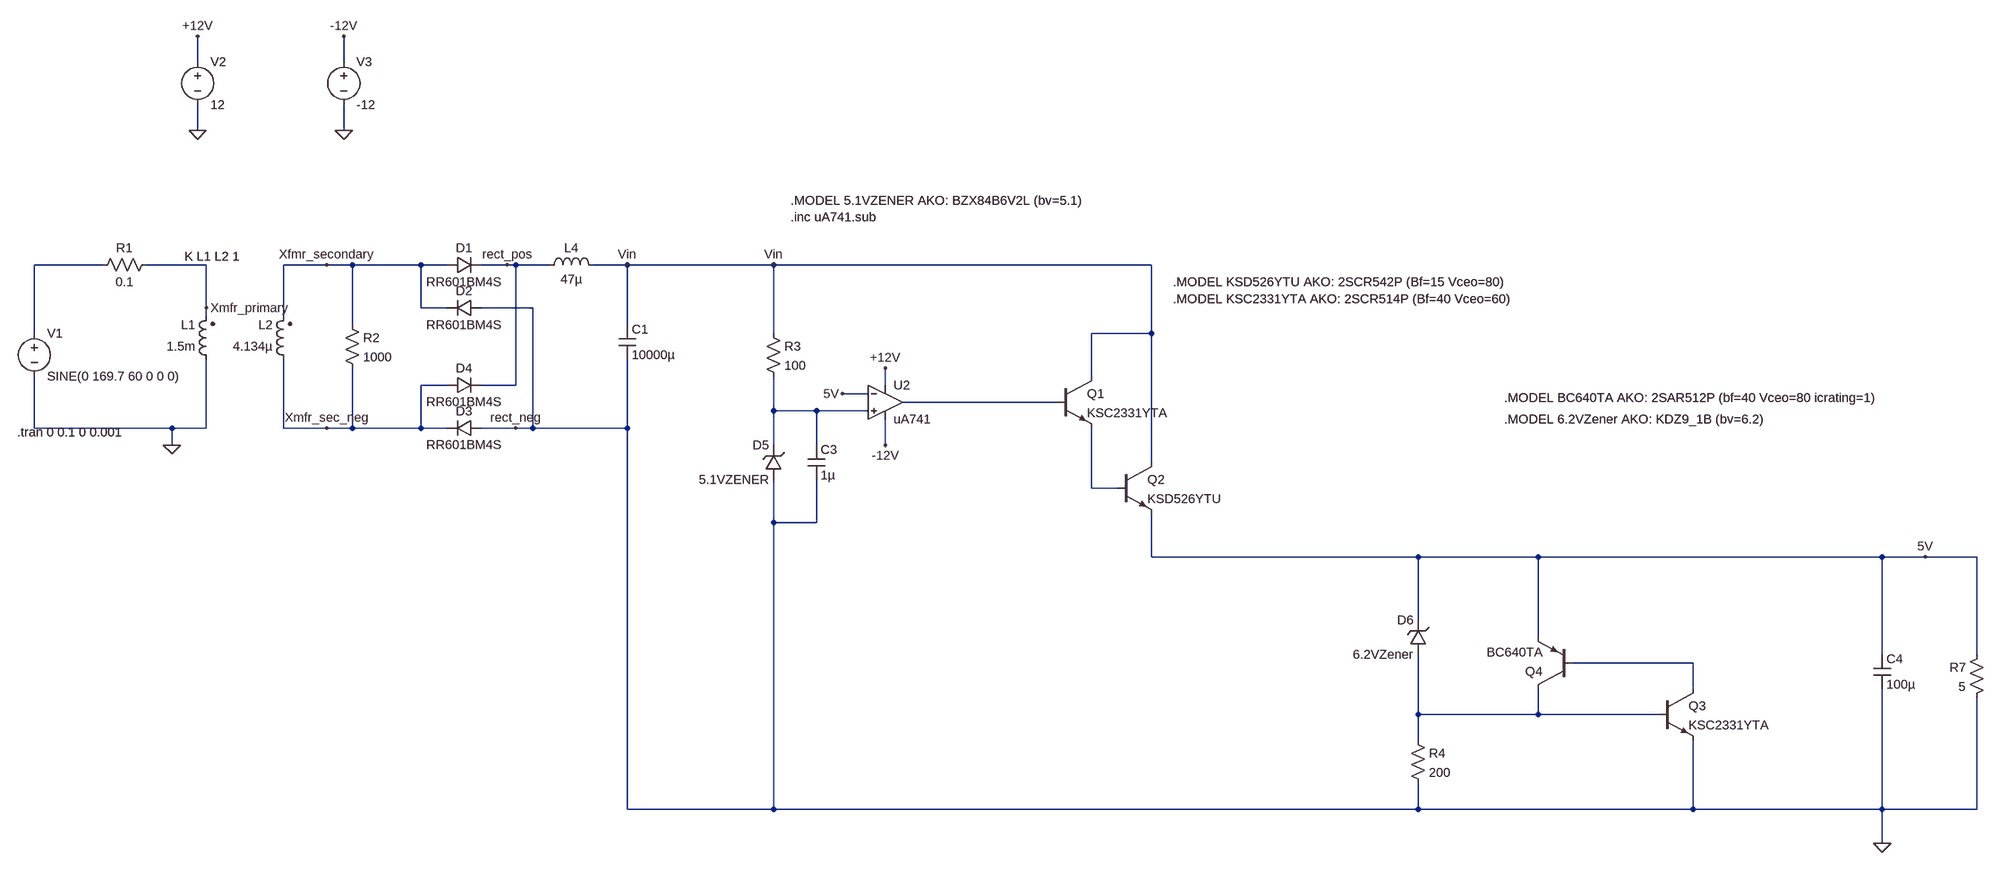
[diagram p0: schematic 5V Supply.asc]
5V Supply.asc, the LTspice schematic file:
Version 4
SHEET 1 3192 1092
WIRE -224 -416 -224 -464
WIRE 48 -416 48 -464
WIRE -224 -288 -224 -336
WIRE 48 -288 48 -336
WIRE -400 -16 -528 -16
WIRE -208 -16 -320 -16
WIRE 16 -16 -64 -16
WIRE 64 -16 16 -16
WIRE 192 -16 64 -16
WIRE 240 -16 192 -16
WIRE 352 -16 304 -16
WIRE 368 -16 352 -16
WIRE 432 -16 368 -16
WIRE 576 -16 512 -16
WIRE 848 -16 576 -16
WIRE 1552 -16 848 -16
WIRE -208 64 -208 -16
WIRE 192 64 192 -16
WIRE 240 64 192 64
WIRE 400 64 304 64
WIRE -208 80 -208 64
WIRE -64 80 -64 -16
WIRE 64 96 64 -16
WIRE 576 96 576 -16
WIRE -528 112 -528 -16
WIRE 848 112 848 -16
WIRE 1552 112 1552 -16
WIRE 1552 112 1440 112
WIRE 1440 192 1440 112
WIRE 240 208 192 208
WIRE 368 208 368 -16
WIRE 368 208 304 208
WIRE 1056 208 1056 176
WIRE 1024 224 976 224
WIRE 1376 240 1088 240
WIRE 848 256 848 192
WIRE 928 256 848 256
WIRE 1024 256 928 256
WIRE -528 288 -528 192
WIRE -272 288 -528 288
WIRE -208 288 -208 160
WIRE -208 288 -272 288
WIRE -64 288 -64 160
WIRE 16 288 -64 288
WIRE 64 288 64 176
WIRE 64 288 16 288
WIRE 192 288 192 208
WIRE 192 288 64 288
WIRE 240 288 192 288
WIRE 368 288 304 288
WIRE 400 288 400 64
WIRE 400 288 368 288
WIRE 576 288 576 160
WIRE 576 288 400 288
WIRE -272 320 -272 288
WIRE 848 320 848 256
WIRE 928 320 928 256
WIRE 1056 320 1056 272
WIRE 1552 352 1552 112
WIRE 1440 400 1440 288
WIRE 1488 400 1440 400
WIRE 848 464 848 384
WIRE 928 464 928 384
WIRE 928 464 848 464
WIRE 1552 528 1552 448
WIRE 2048 528 1552 528
WIRE 2272 528 2048 528
WIRE 2912 528 2272 528
WIRE 2992 528 2912 528
WIRE 3088 528 2992 528
WIRE 2048 656 2048 528
WIRE 2272 688 2272 528
WIRE 2912 720 2912 528
WIRE 3088 720 3088 528
WIRE 2560 736 2336 736
WIRE 2560 784 2560 736
WIRE 2048 832 2048 720
WIRE 2272 832 2272 784
WIRE 2272 832 2048 832
WIRE 2496 832 2272 832
WIRE 2048 880 2048 832
WIRE 576 1008 576 288
WIRE 848 1008 848 464
WIRE 848 1008 576 1008
WIRE 2048 1008 2048 960
WIRE 2048 1008 848 1008
WIRE 2560 1008 2560 880
WIRE 2560 1008 2048 1008
WIRE 2912 1008 2912 784
WIRE 2912 1008 2560 1008
WIRE 3088 1008 3088 800
WIRE 3088 1008 2912 1008
WIRE 2912 1072 2912 1008
FLAG -272 320 0
FLAG -208 64 Xmfr_primary
FLAG 16 -16 Xfmr_secondary
FLAG 16 288 Xmfr_sec_neg
FLAG 368 288 rect_neg
FLAG 352 -16 rect_pos
FLAG 1056 176 +12V
FLAG 1056 320 -12V
FLAG 976 224 5V
FLAG 2992 528 5V
FLAG -224 -288 0
FLAG 48 -288 0
FLAG -224 -464 +12V
FLAG 48 -464 -12V
FLAG 576 -16 Vin
FLAG 848 -16 Vin
FLAG 2912 1072 0
SYMBOL res -304 -32 R90
WINDOW 0 0 56 VBottom 2
WINDOW 3 32 56 VTop 2
SYMATTR InstName R1
SYMATTR Value 0.1
SYMBOL voltage -528 96 R0
WINDOW 123 0 0 Left 2
WINDOW 39 0 0 Left 2
SYMATTR InstName V1
SYMATTR Value SINE(0 169.7 60 0 0 0)
SYMBOL res 48 80 R0
SYMATTR InstName R2
SYMATTR Value 1000
SYMBOL ind2 -192 176 R180
WINDOW 0 36 80 Left 2
WINDOW 3 36 40 Left 2
SYMATTR InstName L1
SYMATTR Value 1.5m
SYMATTR Type ind
SYMBOL ind2 -48 176 R180
WINDOW 0 36 80 Left 2
WINDOW 3 36 40 Left 2
SYMATTR InstName L2
SYMATTR Value 4.134µ
SYMATTR Type ind
SYMBOL diode 240 0 R270
WINDOW 0 32 32 VTop 2
WINDOW 3 0 32 VBottom 2
SYMATTR InstName D1
SYMATTR Value RR601BM4S
SYMBOL diode 304 48 R90
WINDOW 0 0 32 VBottom 2
WINDOW 3 32 32 VTop 2
SYMATTR InstName D2
SYMATTR Value RR601BM4S
SYMBOL diode 304 272 R90
WINDOW 0 0 32 VBottom 2
WINDOW 3 32 32 VTop 2
SYMATTR InstName D3
SYMATTR Value RR601BM4S
SYMBOL diode 240 224 R270
WINDOW 0 32 32 VTop 2
WINDOW 3 0 32 VBottom 2
SYMATTR InstName D4
SYMATTR Value RR601BM4S
SYMBOL cap 560 96 R0
SYMATTR InstName C1
SYMATTR Value 10000µ
SYMBOL ind 416 0 R270
WINDOW 0 32 56 VTop 2
WINDOW 3 5 56 VBottom 2
SYMATTR InstName L4
SYMATTR Value 47µ
SYMBOL zener 864 384 R180
WINDOW 0 24 64 Left 2
WINDOW 3 24 0 Left 2
SYMATTR InstName D5
SYMATTR Value 5.1VZENER
SYMBOL res 832 96 R0
SYMATTR InstName R3
SYMATTR Value 100
SYMBOL npn 1376 192 R0
SYMATTR InstName Q1
SYMATTR Value KSC2331YTA
SYMBOL npn 1488 352 R0
SYMATTR InstName Q2
SYMATTR Value KSD526YTU
SYMBOL cap 912 320 R0
SYMATTR InstName C3
SYMATTR Value 1µ
SYMBOL res 3104 704 M0
SYMATTR InstName R7
SYMATTR Value 5
SYMBOL cap 2896 720 R0
SYMATTR InstName C4
SYMATTR Value 100µ
SYMBOL voltage -224 -432 R0
WINDOW 123 0 0 Left 0
WINDOW 39 0 0 Left 0
SYMATTR InstName V2
SYMATTR Value 12
SYMBOL voltage 48 -432 R0
WINDOW 123 0 0 Left 0
WINDOW 39 0 0 Left 0
SYMATTR InstName V3
SYMATTR Value -12
SYMBOL npn 2496 784 R0
SYMATTR InstName Q3
SYMATTR Value KSC2331YTA
SYMBOL pnp 2336 784 R180
SYMATTR InstName Q4
SYMATTR Value BC640TA
SYMBOL zener 2064 720 R180
WINDOW 0 24 64 Left 2
WINDOW 3 24 0 Left 2
SYMATTR InstName D6
SYMATTR Value 6.2VZener
SYMBOL res 2032 864 R0
SYMATTR InstName R4
SYMATTR Value 200
SYMBOL Opamps\\opamp2 1056 176 R0
SYMATTR InstName U2
SYMATTR Value uA741
TEXT -248 -32 Left 2 !K L1 L2 1
TEXT -560 296 Left 2 !.tran 0 0.1 0 0.001
TEXT 880 -136 Left 2 !.MODEL 5.1VZENER AKO: BZX84B6V2L (bv=5.1)\n.inc uA741.sub
TEXT 2208 272 Left 2 !.MODEL 6.2VZener AKO: KDZ9_1B (bv=6.2)
TEXT 2208 232 Left 2 !.MODEL BC640TA AKO: 2SAR512P (bf=40 Vceo=80 icrating=1)
TEXT 1592 16 Left 2 !.MODEL KSD526YTU AKO: 2SCR542P (Bf=15 Vceo=80)\n.MODEL KSC2331YTA AKO: 2SCR514P (Bf=40 Vceo=60)

The netlist it stands for:
* 5V Supply.asc
R1 Xmfr_primary N001 0.1
V1 N001 0 SINE(0 169.7 60 0 0 0)
R2 Xfmr_secondary Xmfr_sec_neg 1000
L1 0 Xmfr_primary 1.5m
L2 Xmfr_sec_neg Xfmr_secondary 4.134µ
D1 Xfmr_secondary rect_pos RR601BM4S
D2 0 Xfmr_secondary RR601BM4S
D3 0 Xmfr_sec_neg RR601BM4S
D4 Xmfr_sec_neg rect_pos RR601BM4S
C1 Vin 0 10000µ
L4 rect_pos Vin 47µ
D5 0 N003 5.1VZENER
R3 Vin N003 100
Q1 Vin N002 N004 0 KSC2331YTA
Q2 Vin N004 5V 0 KSD526YTU
C3 N003 0 1µ
R7 5V 0 5
C4 5V 0 100µ
V2 +12V 0 12
V3 -12V 0 -12
Q3 N005 N006 0 0 KSC2331YTA
Q4 N006 N005 5V 0 BC640TA
D6 N006 5V 6.2VZener
R4 N006 0 200
XU2 N003 5V +12V -12V N002 uA741  ; pins In+ In- V+ V- OUT
.model D D
.lib standard.dio
.model NPN NPN
.model PNP PNP
.lib standard.bjt
K L1 L2 1
.tran 0 0.1 0 0.001
.MODEL 5.1VZENER AKO: BZX84B6V2L (bv=5.1)
.inc uA741.sub
.MODEL 6.2VZener AKO: KDZ9_1B (bv=6.2)
.MODEL BC640TA AKO: 2SAR512P (bf=40 Vceo=80 icrating=1)
.MODEL KSD526YTU AKO: 2SCR542P (Bf=15 Vceo=80)
.MODEL KSC2331YTA AKO: 2SCR514P (Bf=40 Vceo=60)
.backanno
.end